# Altium project PropMark.PrjPcb (part 2 of 2)

## Sheet 9 h bridge.SchDoc
size A4; DocumentNumber: 9; SheetNumber: 11; SheetTotal: 12
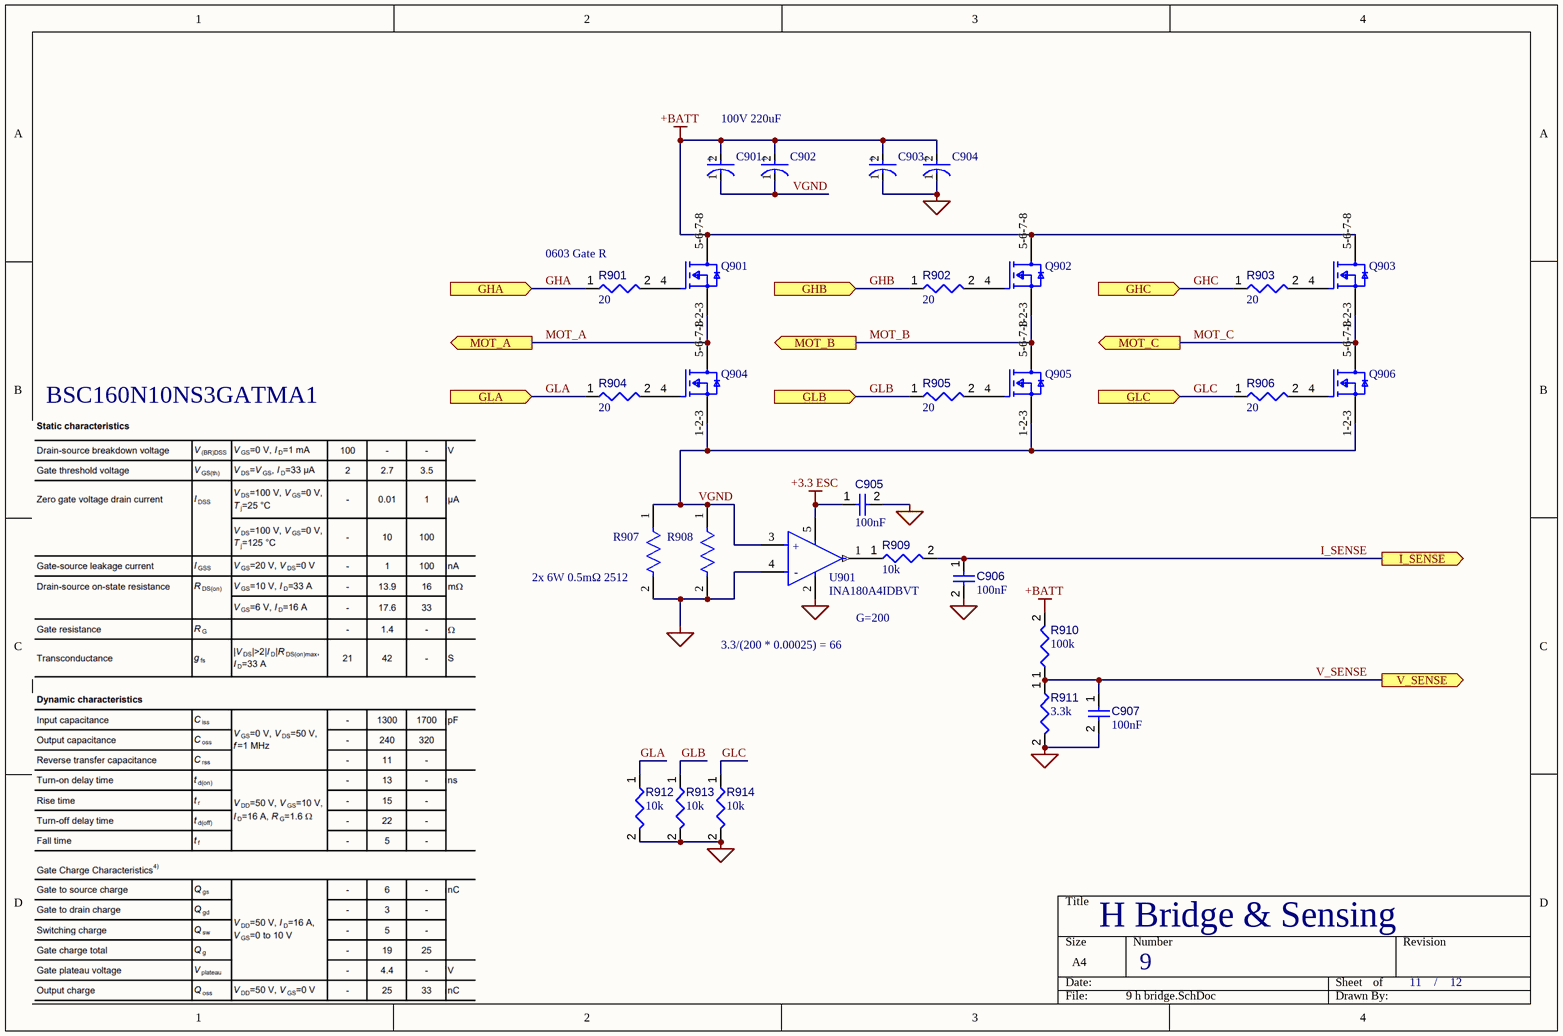
[diagram p9: 9 h bridge.SchDoc]

### Parts
C901  EMVY101ARA101MKE0S  [FP-MVYAKE0-MFG]  (value not drawn)
C902  EMVY101ARA101MKE0S  [FP-MVYAKE0-MFG]  (value not drawn)
C903  EMVY101ARA101MKE0S  [FP-MVYAKE0-MFG]  (value not drawn)
C904  EMVY101ARA101MKE0S  [FP-MVYAKE0-MFG]  (value not drawn)
C905  value 100nF  [CAPC0402(1005)60_L]  (hidden comment: Capacitor 100nF +/-20% 25V 0402)
C906  value 100nF  [CAPC0402(1005)60_L]  (hidden comment: Capacitor 100nF +/-20% 25V 0402)
C907  value 100nF  [CAPC0402(1005)60_L]  (hidden comment: Capacitor 100nF +/-20% 25V 0402)
Q901  IAUC120N06S5N017ATMA1  [FP-PG-TDSON-8-MFG]  (value not drawn)
Q902  IAUC120N06S5N017ATMA1  [FP-PG-TDSON-8-MFG]  (value not drawn)
Q903  IAUC120N06S5N017ATMA1  [FP-PG-TDSON-8-MFG]  (value not drawn)
Q904  IAUC120N06S5N017ATMA1  [FP-PG-TDSON-8-MFG]  (value not drawn)
Q905  IAUC120N06S5N017ATMA1  [FP-PG-TDSON-8-MFG]  (value not drawn)
Q906  IAUC120N06S5N017ATMA1  [FP-PG-TDSON-8-MFG]  (value not drawn)
R901  value 20  [RESC0603(1608)_L]  (hidden comment: Resistor 20R +/-5 % 0603 0.1 W)
R902  value 20  [RESC0603(1608)_L]  (hidden comment: Resistor 20R +/-5 % 0603 0.1 W)
R903  value 20  [RESC0603(1608)_L]  (hidden comment: Resistor 20R +/-5 % 0603 0.1 W)
R904  value 20  [RESC0603(1608)_L]  (hidden comment: Resistor 20R +/-5 % 0603 0.1 W)
R905  value 20  [RESC0603(1608)_L]  (hidden comment: Resistor 20R +/-5 % 0603 0.1 W)
R906  value 20  [RESC0603(1608)_L]  (hidden comment: Resistor 20R +/-5 % 0603 0.1 W)
R907  PSL2NTEBL500F  [FP-PSL2NTEBL500F-MFG]  (value not drawn)
R908  PSL2NTEBL500F  [FP-PSL2NTEBL500F-MFG]  (value not drawn)
R909  value 10k  [RESC0402(1005)_L]  (hidden comment: Resistor 10K  +/-1 % 0402 63 mW)
R910  value 100k  [RESC0402(1005)_L]  (hidden comment: Resistor 100K +/-1 % 0402 63 mW)
R911  value 3.3k  [RESC0402(1005)_L]  (hidden comment: Resistor 3K3 +/-1 % 0402 63 mW)
R912  value 10k  [RESC0402(1005)_L]  (hidden comment: Resistor 10K  +/-1 % 0402 63 mW)
R913  value 10k  [RESC0402(1005)_L]  (hidden comment: Resistor 10K  +/-1 % 0402 63 mW)
R914  value 10k  [RESC0402(1005)_L]  (hidden comment: Resistor 10K  +/-1 % 0402 63 mW)
U901  INA180A4IDBVT  [FP-DBV0005A-MFG]

### Ports
GHA (in), GHB (in), GHC (in), GLA (in), GLB (in), GLC (in), I_SENSE (out), MOT_A (out), MOT_B (out), MOT_C (out), V_SENSE (out)

### Nets
+3.3 ESC: C905.1 U901.5(VS)
+BATT: C901.2(A) C902.2(A) C903.2(A) C904.2(A) Q901.5-6-7-8(D) Q902.5-6-7-8(D) Q903.5-6-7-8(D) R910.2
PGND: C903.1(C) C904.1(C) C905.2 C906.2 C907.2 R907.2 R908.2 R911.2 R912.2 R913.2 R914.2 U901.2(GND) U901.4(IN-)
GHA: R901.1 ; port GHA
GHB: R902.1 ; port GHB
GHC: R903.1 ; port GHC
GLA: R904.1 R912.1 ; port GLA
GLB: R905.1 R913.1 ; port GLB
GLC: R906.1 R914.1 ; port GLC
I_SENSE: C906.1 R909.2 ; port I_SENSE
MOT_A: Q901.1-2-3(S) Q904.5-6-7-8(D) ; port MOT_A
MOT_B: Q902.1-2-3(S) Q905.5-6-7-8(D) ; port MOT_B
MOT_C: Q903.1-2-3(S) Q906.5-6-7-8(D) ; port MOT_C
V_SENSE: C907.1 R910.1 R911.1 ; port V_SENSE
VGND: C901.1(C) C902.1(C) Q904.1-2-3(S) Q905.1-2-3(S) Q906.1-2-3(S) R907.1 R908.1 U901.3(IN+)
NetQ901_4: Q901.4(G) R901.2
NetQ902_4: Q902.4(G) R902.2
NetQ903_4: Q903.4(G) R903.2
NetQ904_4: Q904.4(G) R904.2
NetQ905_4: Q905.4(G) R905.2
NetQ906_4: Q906.4(G) R906.2
NetR909_1: R909.1 U901.1(OUT)

### Notes on the sheet
- 100V 220uF
- (near R901) 0603 Gate R
- BSC160N10NS3GATMA1
- (near R907) 2x 6W 0.5mΩ 2512
- 3.3/(200 * 0.00025) = 66
- G=200
- H Bridge & Sensing
- /
- (in symbol CMP-04895-000007-1) +; -
- (in symbol CMP-33768-000015-1) +

### Library data of the parts
C901-C904 = CMP-33768-000015-1: CAP ALUM 100UF 20% 100V SMD; Life (Hours): 5000Hour; Ripple Current: 450mA; ESR (Equivalent Series Resistance): 330mR; Dielectric Material: Aluminium; Voltage Rating: 100V; Min Operating Temperature: -40°C; Voltage Rating (DC): 100V; Construction: Cylindrical; Height - Seated (Max): 0.531inch; Tolerance: 20%; Termination: SMD/SMT; Diameter: 12.5mm; Mount: Surface Mount; Series: MVY; Height: 13.5mm; Lead Free: Lead Free; Width: 13mm; Case/Package: Radial; Ripple Current (AC): 450mA; Capacitance: 100uF; Packaging: Tape and Reel; Impedance: 330mR; Length: 0.53inch; Package Quantity: 200; RoHS Compliant: Yes; Max Operating Temperature: 105°C
C905-C907 = CMP-001-00065-4: Chip Capacitor, 100nF +/-20%, 25V, 0402, Thickness 0.6 mm; Tolerance: 10%; Max Operating Temperature: 85°C; Min Operating Temperature: -55°C; Pins: 2; Voltage Rating: 25V; Mounting Technology: SMT; Case/Package: 0402
Q901-Q906 = CMP-32901-000676-1: MOSFET N-CH 60V 120A TDSON-8-43
R901-R906 = CMP-009-00183-1: Chip Resistor, 20 Ohms, +/-5 %, 0.1 W, -55 to 155 degC, 0603; Tolerance: 5%; Power: 100mW; Pins: 2; Max Operating Temperature: 155°C; Case/Package: 0603; Min Operating Temperature: -55°C
R907 R908 = CMP-04015-070281-1: RES 500 UOHM 1% 8W NONSTANDARD; RoHS Compliant: Yes
R909 R912-R914 = CMP-009-00149-3: Chip Resistor, 10 kOhms, +/-1 %, 63 mW, -55 to 125 degC, 0402; Power: 63mW; Tolerance: 1%; Min Operating Temperature: -55°C; Case/Package: 0402; Max Operating Temperature: 155°C; Pins: 2
R910 = CMP-009-00168-3: Chip Resistor, 100 kOhms, +/-1 %, 63 mW, -55 to 155 degC, 0402; Tolerance: 1%; Power: 63mW; Max Operating Temperature: 155°C; Min Operating Temperature: -55°C; Pins: 2; Case/Package: 0402
R911 = CMP-009-00145-3: Chip Resistor, 3.3 kOhms, +/-1 %, 63 mW, -55 to 155 degC, 0402; Tolerance: 1%; Power: 63mW; Case/Package: 0402; Min Operating Temperature: -55°C; Max Operating Temperature: 155°C; Pins: 2
U901 = CMP-04895-000007-1: IC CURR SENSE 1 CIRCUIT SOT23-5; Manufacturer: Texas Instruments; Output Current Per Channel: 8mA; Max Supply Voltage: 5.5V; Input Bias Current: 80uA; Bandwidth: 105kHz; Min Supply Voltage: 2.7V; Input Offset Voltage: 0.1mV; Number Of Channels: 1; Max Junction Temp: +150°C; Standoff Height: 0mm; Nominal Supply Current: 197uA; Voltage Gain: 0.2V/mV; Temperature: -40°C to +125°C; RoHS: TRUE; Ambient Temperature Range High: +125°C; Device Class L3: Instrumentation; Temperature Range High: +125°C; Height: 1.45mm; Octopart: https://octopart.com/ina180a4idbvt-texas+instruments-81856280; ComponentLink2Description: Datasheet; Digikey Description: IC CURR SENSE 1 CIRCUIT SOT23-5; Category: IC; ComponentLink2URL: http://www.ti.com/lit/ds/symlink/ina180.pdf; Ambient Temperature Range Low: -40°C; Temperature Range Low: -40°C; Automotive: No; Package: DBV0005A; Device Class L1: Integrated Circuits (ICs); Ipc Land Pattern Name: SOT95P280X145-5; Manufacturer Part Number: INA180A4IDBVT; Device Class L2: Linear ICs; Lead Free: Yes

## Sheet 8 gate driver.SchDoc
size A4; DocumentNumber: 8; SheetNumber: 10; SheetTotal: 12
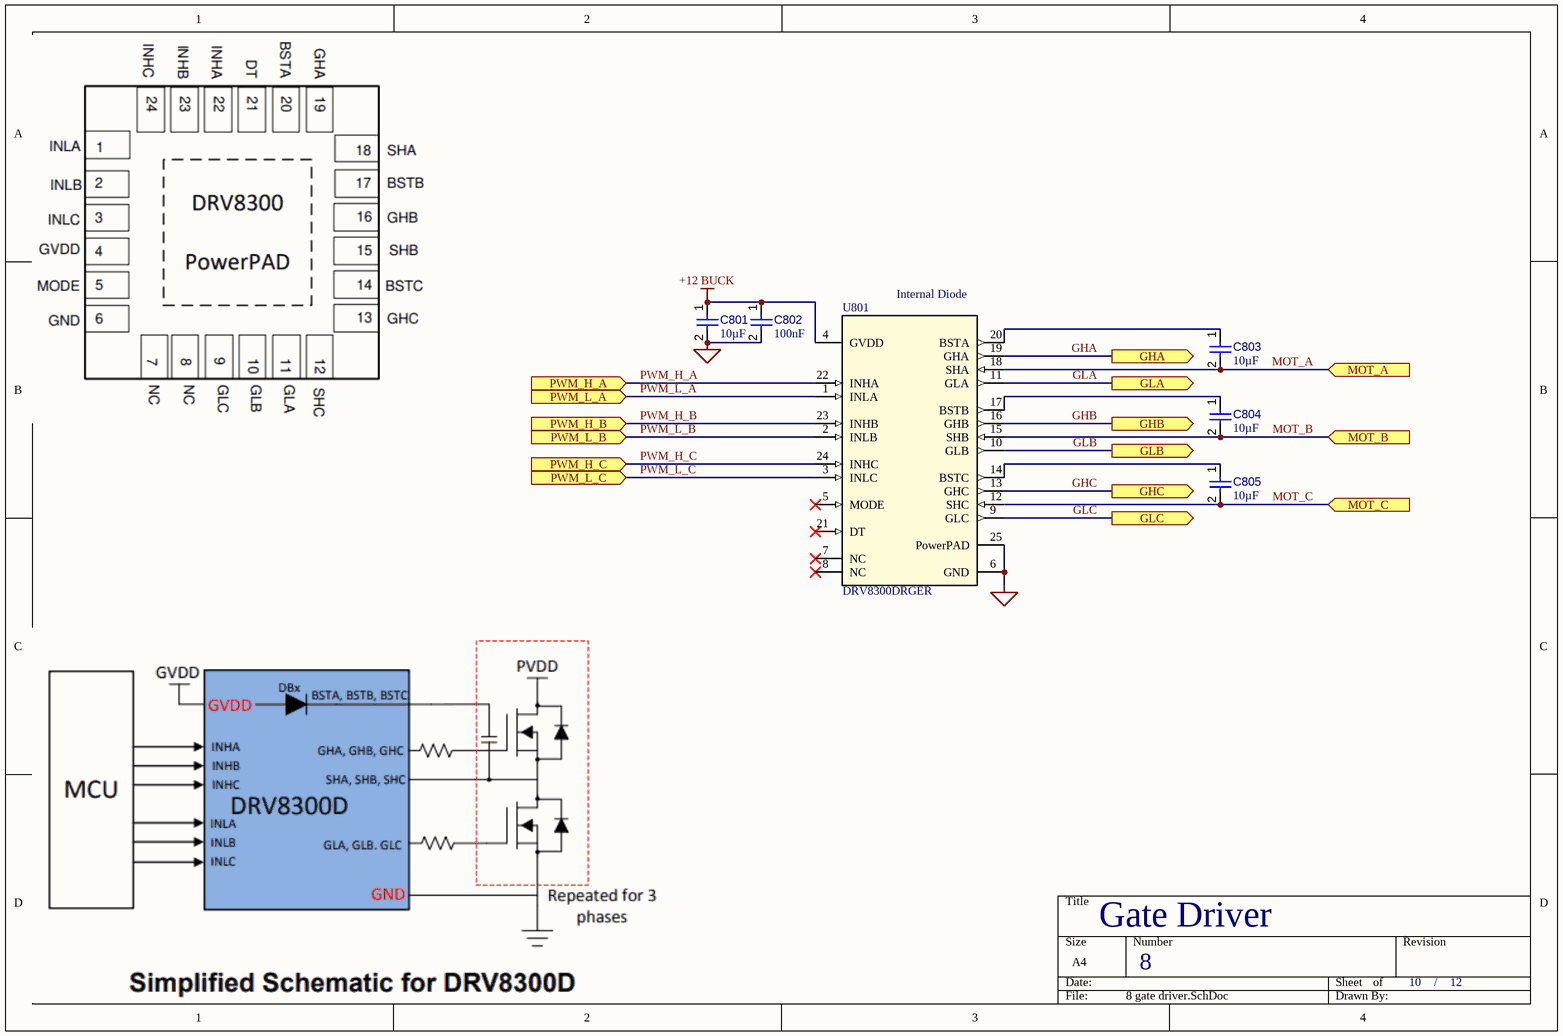
[diagram p10: 8 gate driver.SchDoc]

### Parts
C801  value 10µF  [CAPC0603(1608)100_L]  (hidden comment: Capacitor 10µF +/-20% 10V 0603)
C802  value 100nF  [CAPC0402(1005)60_L]  (hidden comment: Capacitor 100nF +/-20% 25V 0402)
C803  value 10µF  [CAPC0603(1608)100_L]  (hidden comment: Capacitor 10µF +/-20% 10V 0603)
C804  value 10µF  [CAPC0603(1608)100_L]  (hidden comment: Capacitor 10µF +/-20% 10V 0603)
C805  value 10µF  [CAPC0603(1608)100_L]  (hidden comment: Capacitor 10µF +/-20% 10V 0603)
U801  DRV8300DRGER  [RGE0024B-MFG]

### Ports
GHA (out), GHB (out), GHC (out), GLA (out), GLB (out), GLC (out), MOT_A (in), MOT_B (in), MOT_C (in), PWM_H_A (in), PWM_H_B (in), PWM_H_C (in), PWM_L_A (in), PWM_L_B (in), PWM_L_C (in)

### Nets
+12 BUCK: C801.1 C802.1 U801.4(GVDD)
PGND: C801.2 C802.2 U801.6(GND) U801.25(PowerPAD)
GHA: U801.19(GHA) ; port GHA
GHB: U801.16(GHB) ; port GHB
GHC: U801.13(GHC) ; port GHC
GLA: U801.11(GLA) ; port GLA
GLB: U801.10(GLB) ; port GLB
GLC: U801.9(GLC) ; port GLC
MOT_A: C803.2 U801.18(SHA) ; port MOT_A
MOT_B: C804.2 U801.15(SHB) ; port MOT_B
MOT_C: C805.2 U801.12(SHC) ; port MOT_C
PWM_H_A: U801.22(INHA) ; port PWM_H_A
PWM_H_B: U801.23(INHB) ; port PWM_H_B
PWM_H_C: U801.24(INHC) ; port PWM_H_C
PWM_L_A: U801.1(INLA) ; port PWM_L_A
PWM_L_B: U801.2(INLB) ; port PWM_L_B
PWM_L_C: U801.3(INLC) ; port PWM_L_C
NetC803_1: C803.1 U801.20(BSTA)
NetC804_1: C804.1 U801.17(BSTB)
NetC805_1: C805.1 U801.14(BSTC)

Not connected (* = marked no-connect by the designer): U801 5(MODE)* 7(NC)* 8(NC)* 21(DT)*

### Notes on the sheet
- (near U801) Internal Diode
- Gate Driver
- /

### Library data of the parts
C801 C803-C805 = CMP-001-00075-4: Chip Capacitor, 10µF +/-20%, 10V, 0603, Thickness 1 mm; Tolerance: 10%; Voltage Rating: 10V; Max Operating Temperature: 85°C; Pins: 2; Case/Package: 0603; Mounting Technology: SMT; Min Operating Temperature: -55°C
C802 = CMP-001-00065-4: as C905 on sheet 9 h bridge; Max Operating Temperature: 85°C; Min Operating Temperature: -55°C; Pins: 2; Voltage Rating: 25V; Mounting Technology: SMT; Case/Package: 0402
U801 = DRV8300DRGER: No Description Available; Mfr_Name: Texas Instruments; TYPE: TYPE; RefDes: RefDes

## Sheet 10 isolator.SchDoc
size A4; DocumentNumber: 10; SheetNumber: 12; SheetTotal: 12
Used 3 times, as channels Isolator, Isolator, Isolator. Parts and nets are listed once, with the designators drawn on the sheet.
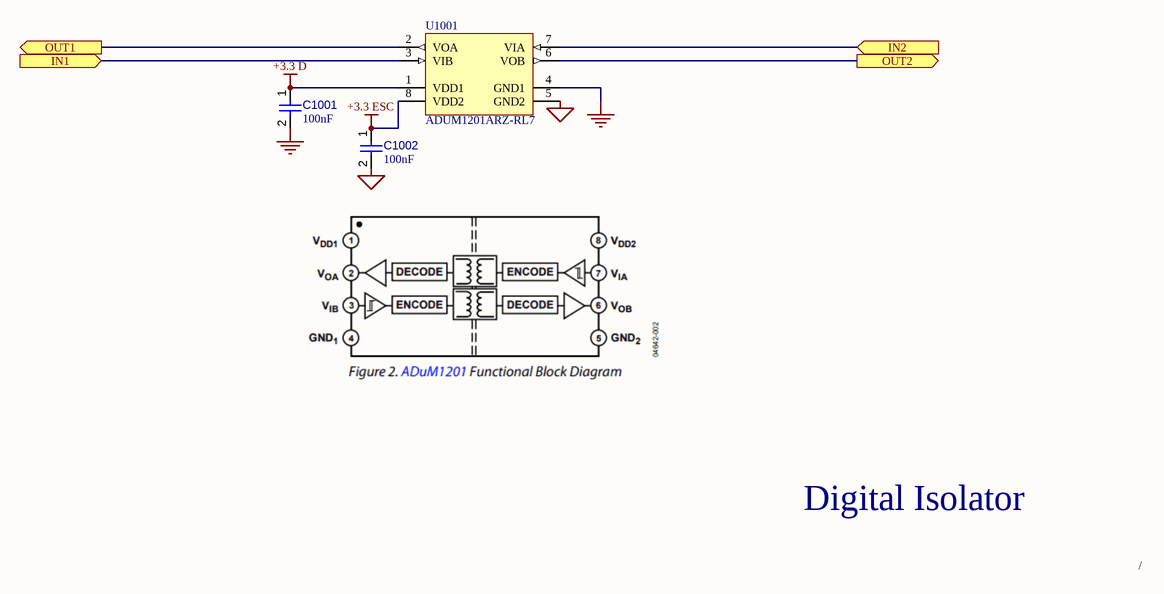
[diagram p11: 10 isolator.SchDoc]

### Parts
C1001  value 100nF  [CAPC0402(1005)60_L]  (hidden comment: Capacitor 100nF +/-20% 25V 0402)
C1002  value 100nF  [CAPC0402(1005)60_L]  (hidden comment: Capacitor 100nF +/-20% 25V 0402)
U1001  ADUM1201ARZ-RL7  [ADI-R-8_L]

### Ports
IN1 (in), IN2 (in), OUT1 (out), OUT2 (out)

### Nets
+3.3 D: C1001.1 U1001.1(VDD1)
+3.3 ESC: C1002.1 U1001.8(VDD2)
GND: C1001.2 U1001.4(GND1)
PGND: C1002.2 U1001.5(GND2)
IN1: U1001.3(VIB) ; port IN1
IN2: U1001.7(VIA) ; port IN2
OUT1: U1001.2(VOA) ; port OUT1
OUT2: U1001.6(VOB) ; port OUT2

### Channels
Isolator: designators end in _Isolator#1; ports IN1=NetU201_4 IN2=ESC_TELEM OUT1=NetU201_95 OUT2=ESC_SIG
Isolator: designators end in _Isolator#2; ports IN1=NetU201_5 IN2=PGND OUT1=NetU1001_Isolator#2_2 OUT2=ESC_SEL
Isolator: designators end in _Isolator#3; ports IN1=TXD1 IN2=ESC_TX OUT1=RXD1 OUT2=ESC_RX

### Notes on the sheet
- Digital Isolator
- /

### Library data of the parts
C1001 C1002 = CMP-001-00065-4: as C905 on sheet 9 h bridge; Max Operating Temperature: 85°C; Min Operating Temperature: -55°C; Pins: 2; Voltage Rating: 25V; Mounting Technology: SMT; Case/Package: 0402
U1001 = CMP-0534-00063-1: Dual Channel Digital Isolator, 2.5 KV rms Insulation Rating, 1 Mbps Data Rate, 150 ns Delay, Industrial, 8-pin SOIC (R-8), Reel; Manufacturer: Analog Devices; Insulation Rating (kVrms): 2.5; Max Data Rate: 1Mbps; ComponentLink3Description: Package Specification; ComponentLink1Description: Manufacturer URL; ComponentLink4Description: URL Link1; PackageReference: R-8; PackageVersion: 060506-A, 06/2006; ComponentLink3URL: http://www.analog.com/static/imported-files/packages/PKG_PDF/SOIC_Narrow%20(R)/R_8.pdf; ComponentLink5Description: URL Link2; ComponentLink2Description: Datasheet; Mounting Technology: Surface Mount; ComponentLink5URL: Reference Circuit:http://www.analog.com/en/interface-isolation/digital-isolators/adum1201/products/product.html#product-recommendations; Code_JEDEC: MS-012-AA; DatasheetVersion: Rev. I; PartNumber: ADUM1201ARZ-RL7; ComponentLink1URL: http://www.analog.com/en/index.html; ComponentLink2URL: http://www.analog.com/static/imported-files/data_sheets/ADuM1200_1201.pdf; Max Operating Temp (degreesC): 125; PackageDescription: 8-Pin Standard Small Outline Package, Body 4.9 x 3.9 mm, Pitch 1.27 mm; ComponentLink4URL: Product URL:http://www.analog.com/en/interface-isolation/digital-isolators/adum1201/products/product.html

## Nets that join several sheets
+1.65 REF: 1 power (U104.1 U104.4), Amplifiers1 (U601_Amplifiers1.5), Amplifiers2 (U601_Amplifiers2.5), Amplifiers3 (U601_Amplifiers3.5), Amplifiers4 (U601_Amplifiers4.5), Amplifiers5 (U601_Amplifiers5.5), Amplifiers6 (U601_Amplifiers6.5)
+3.3 A: 1 power (8 pins), 2 main mcu (C209.1 C210.1 U201.20 U201.21), Amplifiers1 (C601_Amplifiers1.1 P601_Amplifiers1.4 U601_Amplifiers1.7), Amplifiers2 (C601_Amplifiers2.1 P601_Amplifiers2.4 U601_Amplifiers2.7), Amplifiers3 (C601_Amplifiers3.1 P601_Amplifiers3.4 U601_Amplifiers3.7), Amplifiers4 (C601_Amplifiers4.1 P601_Amplifiers4.4 U601_Amplifiers4.7), Amplifiers5 (C601_Amplifiers5.1 P601_Amplifiers5.4 U601_Amplifiers5.7), Amplifiers6 (C601_Amplifiers6.1 P601_Amplifiers6.4 U601_Amplifiers6.7)
+3.3 D: 1 power (6 pins), 2 main mcu (15 pins), 3 ports (C302.1 U301.7), 4 memory (10 pins), Isolator (C1001_Isolator#1.1 U1001_Isolator#1.1), Isolator (C1001_Isolator#2.1 U1001_Isolator#2.1), Isolator (C1001_Isolator#3.1 U1001_Isolator#3.1)
+3.3 ESC: 1 power (5 pins), 7 esc (9 pins), 9 h bridge (C905.1 U901.5), Isolator (C1002_Isolator#1.1 U1001_Isolator#1.8), Isolator (C1002_Isolator#2.1 U1001_Isolator#2.8), Isolator (C1002_Isolator#3.1 U1001_Isolator#3.8)
+5 USB: 1 power (10 pins), 3 ports (6 pins), 5 led (21 pins)
+12 BUCK: 1 power (9 pins), 8 gate driver (C801.1 C802.1 U801.4)
+BATT: 1 power (6 pins), 9 h bridge (8 pins)
GND: 1 power (20 pins), 2 main mcu (25 pins), 3 ports (21 pins), 4 memory (12 pins), 5 led (20 pins), Amplifiers1 (5 pins), Amplifiers2 (5 pins), Amplifiers3 (5 pins), Amplifiers4 (5 pins), Amplifiers5 (5 pins), Amplifiers6 (5 pins), Isolator (C1001_Isolator#1.2 U1001_Isolator#1.4), Isolator (C1001_Isolator#2.2 U1001_Isolator#2.4), Isolator (C1001_Isolator#3.2 U1001_Isolator#3.4)
PGND: 1 power (18 pins), 7 esc (14 pins), 9 h bridge (13 pins), 8 gate driver (C801.2 C802.2 U801.6 U801.25), Isolator (C1002_Isolator#1.2 U1001_Isolator#1.5), Isolator (C1002_Isolator#2.2 U1001_Isolator#2.5 U1001_Isolator#2.7), Isolator (C1002_Isolator#3.2 U1001_Isolator#3.5)
ESC_RX: 7 esc (D701.2), Isolator (U1001_Isolator#3.6)
ESC_SEL: 7 esc (U701.6), Isolator (U1001_Isolator#2.6)
ESC_SIG: 7 esc (U701.1), Isolator (U1001_Isolator#1.6)
ESC_TELEM: 7 esc (R701.2), Isolator (U1001_Isolator#1.7)
ESC_TX: 7 esc (D701.1 U701.3), Isolator (U1001_Isolator#3.7)
GHA: 9 h bridge (R901.1), 8 gate driver (U801.19)
GHB: 9 h bridge (R902.1), 8 gate driver (U801.16)
GHC: 9 h bridge (R903.1), 8 gate driver (U801.13)
GLA: 9 h bridge (R904.1 R912.1), 8 gate driver (U801.11)
GLB: 9 h bridge (R905.1 R913.1), 8 gate driver (U801.10)
GLC: 9 h bridge (R906.1 R914.1), 8 gate driver (U801.9)
I_SENSE: 7 esc (U702.3), 9 h bridge (C906.1 R909.2)
MOT_A: 7 esc (R704.2), 9 h bridge (Q901.1-2-3 Q904.5-6-7-8), 8 gate driver (C803.2 U801.18)
MOT_B: 7 esc (R706.2), 9 h bridge (Q902.1-2-3 Q905.5-6-7-8), 8 gate driver (C804.2 U801.15)
MOT_C: 7 esc (R708.2), 9 h bridge (Q903.1-2-3 Q906.5-6-7-8), 8 gate driver (C805.2 U801.12)
NetU201_4: 2 main mcu (U201.4), Isolator (U1001_Isolator#1.3)
NetU201_5: 2 main mcu (U201.5), Isolator (U1001_Isolator#2.3)
NetU201_95: 2 main mcu (U201.95), Isolator (U1001_Isolator#1.2)
PWM_H_A: 7 esc (U702.20), 8 gate driver (U801.22)
PWM_H_B: 7 esc (U702.19), 8 gate driver (U801.23)
PWM_H_C: 7 esc (U702.18), 8 gate driver (U801.24)
PWM_L_A: 7 esc (U702.2), 8 gate driver (U801.1)
PWM_L_B: 7 esc (U702.13), 8 gate driver (U801.2)
PWM_L_C: 7 esc (U702.12), 8 gate driver (U801.3)
QSPI_CLK: 2 main mcu (U201.36), 4 memory (U401.6)
QSPI_NCS: 2 main mcu (U201.46), 4 memory (R401.2 U401.1)
RGB_DAT: 2 main mcu (U201.63), 5 led (R501.2 U501.4)
RXD0: 2 main mcu (U201.98), 3 ports (U301.9)
RXD1: 3 ports (U301.6), Isolator (U1001_Isolator#3.2)
SD_CLK: 2 main mcu (U201.80), 4 memory (D402.1 MICRO_SD401.5)
SD_CMD: 2 main mcu (U201.83), 4 memory (D402.2 MICRO_SD401.3 R402.2)
TXD0: 2 main mcu (U201.97), 3 ports (U301.8)
TXD1: 3 ports (U301.5), Isolator (U1001_Isolator#3.3)
USB_D_N: 2 main mcu (U201.70), 3 ports (J301.A7 J301.B7)
USB_D_P: 2 main mcu (U201.71), 3 ports (J301.A6 J301.B6)
V_SENSE: 7 esc (U702.11), 9 h bridge (C907.1 R910.1 R911.1)